# Altium schematic sheet USB-A FEMALE C2681562.schdoc
size 127 x 99 mm
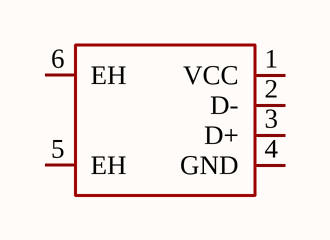
[diagram p0: USB-A FEMALE C2681562.schdoc]

## Parts
USB?  10.0 180° ZCJB-HJ  [USB-A-TH_ZCJB-HJ]  (value not drawn)

## Nets

Not connected (* = marked no-connect by the designer): USB? 1(VCC) 2(D-) 3(D+) 4(GND) 5(EH) 6(EH)

## Library data of the parts
USB? = 10.0 180° ZCJB-HJ: Manufacturer: SHOU HAN(首韩); Add into BOM: yes; Connector Type: Type-A; Gender: 母; Number of Contacts: 4P; Number of Ports: 1; Current Rating - Power (Max): 1.5A; Rated Voltage (Max): 30V; Connect-Disconnect Life: 5千次; Core Colour: 黑色; Symbol: 10.0 180° ZCJB-HJ; Device: 10.0 180° ZCJB-HJ; LCSC Part Name: Type-A 母 直插; Supplier Part: C2681562; Manufacturer Part: 10.0 180° ZCJB-HJ; Supplier Footprint: 插件; JLCPCB Part Class: Extended Part; Datasheet: https://atta.szlcsc.com/upload/public/pdf/source/20210122/C2681562_F87A6740E9F2C84060948B1B5DBCB2C0.pdf; Supplier: LCSC; Convert to PCB: yes; Standard: USB 2.0; Mounting Style: 直插; Supplementary Features: -; Center Height: -; Length: 10mm; Operating Temperature Range: -25℃~+85℃